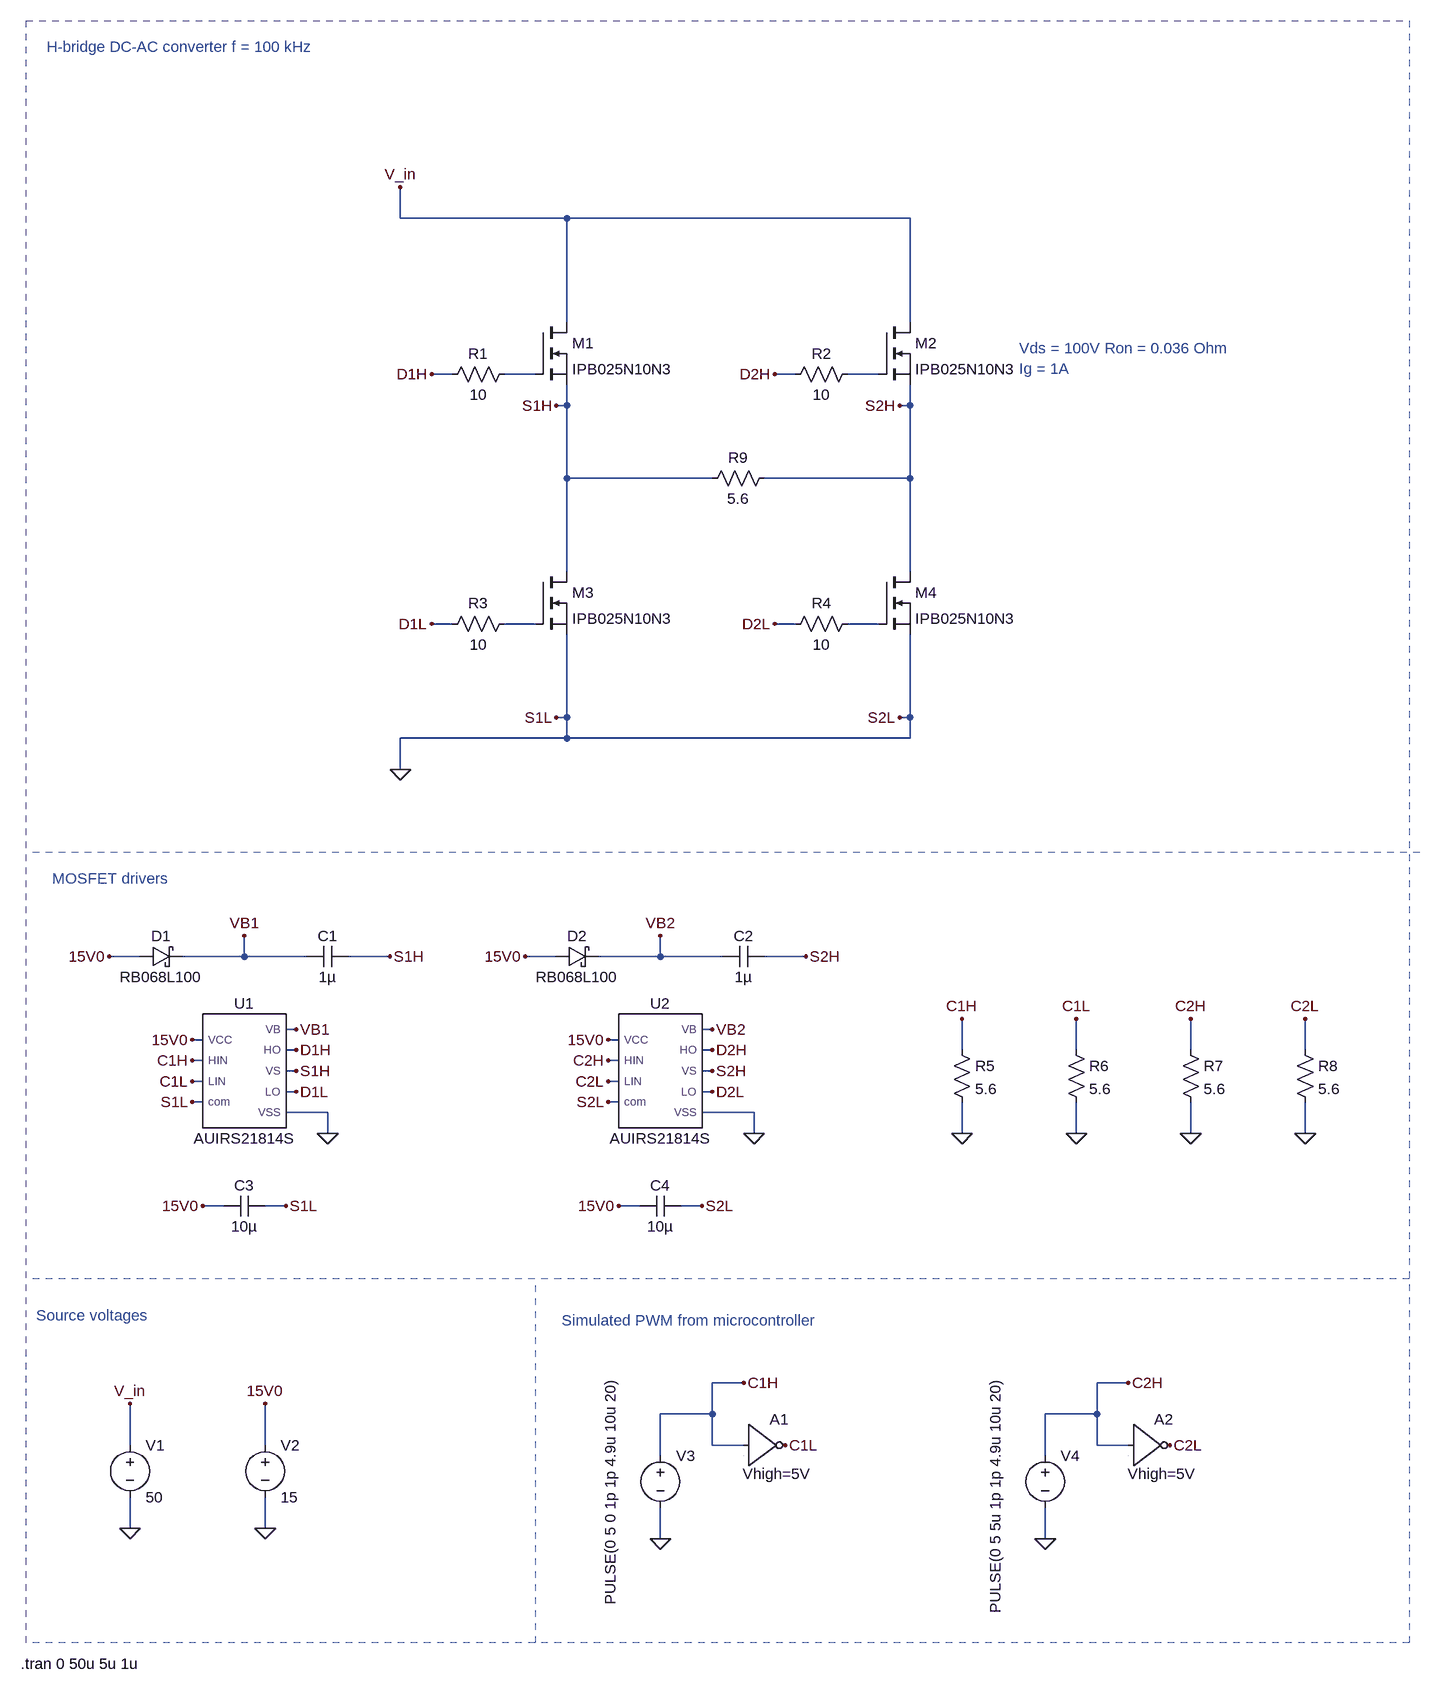
[diagram p0: schematic bridge_driver.asc]
bridge_driver.asc, the LTspice schematic file:
Version 4
SHEET 1 2980 1604
WIRE 1408 -896 1408 -944
WIRE 1664 -896 1408 -896
WIRE 2192 -896 1664 -896
WIRE 1664 -736 1664 -896
WIRE 2192 -736 2192 -896
WIRE 1488 -656 1456 -656
WIRE 1616 -656 1568 -656
WIRE 2016 -656 1984 -656
WIRE 2144 -656 2096 -656
WIRE 1664 -608 1664 -640
WIRE 1664 -608 1648 -608
WIRE 2192 -608 2192 -640
WIRE 2192 -608 2176 -608
WIRE 1664 -496 1664 -608
WIRE 1888 -496 1664 -496
WIRE 2192 -496 2192 -608
WIRE 2192 -496 1968 -496
WIRE 1664 -352 1664 -496
WIRE 2192 -352 2192 -496
WIRE 1488 -272 1456 -272
WIRE 1616 -272 1568 -272
WIRE 2016 -272 1984 -272
WIRE 2144 -272 2096 -272
WIRE 1664 -128 1664 -256
WIRE 1664 -128 1648 -128
WIRE 2192 -128 2192 -256
WIRE 2192 -128 2176 -128
WIRE 1664 -96 1664 -128
WIRE 1664 -96 1408 -96
WIRE 2192 -96 2192 -128
WIRE 2192 -96 1664 -96
WIRE 1408 -48 1408 -96
WIRE 1008 240 960 240
WIRE 1168 240 1168 208
WIRE 1168 240 1072 240
WIRE 1264 240 1168 240
WIRE 1392 240 1328 240
WIRE 1648 240 1600 240
WIRE 1808 240 1808 208
WIRE 1808 240 1712 240
WIRE 1904 240 1808 240
WIRE 2032 240 1968 240
WIRE 1248 352 1232 352
WIRE 1888 352 1872 352
WIRE 1104 368 1088 368
WIRE 1744 368 1728 368
WIRE 1248 384 1232 384
WIRE 1888 384 1872 384
WIRE 2272 384 2272 336
WIRE 2448 384 2448 336
WIRE 2624 384 2624 336
WIRE 2800 384 2800 336
WIRE 1104 400 1088 400
WIRE 1744 400 1728 400
WIRE 1248 416 1232 416
WIRE 1888 416 1872 416
WIRE 1104 432 1088 432
WIRE 1744 432 1728 432
WIRE 1248 448 1232 448
WIRE 1888 448 1872 448
WIRE 1104 464 1088 464
WIRE 1744 464 1728 464
WIRE 1296 480 1232 480
WIRE 1952 480 1872 480
WIRE 1296 512 1296 480
WIRE 1952 512 1952 480
WIRE 2272 512 2272 464
WIRE 2448 512 2448 464
WIRE 2624 512 2624 464
WIRE 2800 512 2800 464
WIRE 1136 624 1104 624
WIRE 1232 624 1200 624
WIRE 1776 624 1744 624
WIRE 1872 624 1840 624
WIRE 1936 896 1888 896
WIRE 2528 896 2480 896
WIRE 1888 944 1888 896
WIRE 1888 944 1808 944
WIRE 2480 944 2480 896
WIRE 2480 944 2400 944
WIRE 992 992 992 928
WIRE 1200 992 1200 928
WIRE 1888 992 1888 944
WIRE 1936 992 1888 992
WIRE 2480 992 2480 944
WIRE 2528 992 2480 992
WIRE 1808 1008 1808 944
WIRE 2400 1008 2400 944
WIRE 992 1120 992 1072
WIRE 1200 1120 1200 1072
WIRE 1808 1136 1808 1088
WIRE 2400 1136 2400 1088
FLAG 992 1120 0
FLAG 1200 1120 0
FLAG 992 928 V_in
FLAG 1200 928 15V0
FLAG 960 240 15V0
FLAG 1168 208 VB1
FLAG 1392 240 S1H
FLAG 1408 -48 0
FLAG 1408 -944 V_in
FLAG 2176 -608 S2H
FLAG 1648 -608 S1H
FLAG 1648 -128 S1L
FLAG 2176 -128 S2L
FLAG 1456 -656 D1H
FLAG 1984 -656 D2H
FLAG 1984 -272 D2L
FLAG 1456 -272 D1L
FLAG 1600 240 15V0
FLAG 1808 208 VB2
FLAG 2032 240 S2H
FLAG 2272 512 0
FLAG 2448 512 0
FLAG 2624 512 0
FLAG 2800 512 0
FLAG 2272 336 C1H
FLAG 2448 336 C1L
FLAG 2624 336 C2H
FLAG 2800 336 C2L
FLAG 1808 1136 0
FLAG 1088 368 15V0
FLAG 1728 368 15V0
FLAG 1088 400 C1H
FLAG 1088 432 C1L
FLAG 1728 400 C2H
FLAG 1728 432 C2L
FLAG 1088 464 S1L
FLAG 1728 464 S2L
FLAG 1296 512 0
FLAG 1952 512 0
FLAG 1248 416 S1H
FLAG 1888 416 S2H
FLAG 1248 352 VB1
FLAG 1888 352 VB2
FLAG 1248 384 D1H
FLAG 1248 448 D1L
FLAG 1888 384 D2H
FLAG 1888 448 D2L
FLAG 1104 624 15V0
FLAG 1232 624 S1L
FLAG 1744 624 15V0
FLAG 1872 624 S2L
FLAG 1936 896 C1H
FLAG 2000 992 C1L
FLAG 2400 1136 0
FLAG 2528 896 C2H
FLAG 2592 992 C2L
SYMBOL AUIRS21814S 1168 416 R0
SYMATTR InstName U1
SYMBOL cap 1328 224 R90
WINDOW 0 0 32 VBottom 2
WINDOW 3 32 32 VTop 2
SYMATTR InstName C1
SYMATTR Value 1µ
SYMBOL schottky 1008 256 R270
WINDOW 0 32 32 VTop 2
WINDOW 3 0 32 VBottom 2
SYMATTR InstName D1
SYMATTR Value RB068L100
SYMATTR Description Diode
SYMATTR Type diode
SYMBOL voltage 992 976 R0
WINDOW 123 0 0 Left 0
WINDOW 39 0 0 Left 0
SYMATTR InstName V1
SYMATTR Value 50
SYMBOL voltage 1200 976 R0
WINDOW 123 0 0 Left 0
WINDOW 39 0 0 Left 0
SYMATTR InstName V2
SYMATTR Value 15
SYMBOL nmos 1616 -736 R0
SYMATTR InstName M1
SYMATTR Value IPB025N10N3
SYMBOL res 1584 -672 R90
WINDOW 0 0 56 VBottom 2
WINDOW 3 32 56 VTop 2
SYMATTR InstName R1
SYMATTR Value 10
SYMBOL res 2112 -672 R90
WINDOW 0 0 56 VBottom 2
WINDOW 3 32 56 VTop 2
SYMATTR InstName R2
SYMATTR Value 10
SYMBOL res 1584 -288 R90
WINDOW 0 0 56 VBottom 2
WINDOW 3 32 56 VTop 2
SYMATTR InstName R3
SYMATTR Value 10
SYMBOL res 2112 -288 R90
WINDOW 0 0 56 VBottom 2
WINDOW 3 32 56 VTop 2
SYMATTR InstName R4
SYMATTR Value 10
SYMBOL cap 1968 224 R90
WINDOW 0 0 32 VBottom 2
WINDOW 3 32 32 VTop 2
SYMATTR InstName C2
SYMATTR Value 1µ
SYMBOL schottky 1648 256 R270
WINDOW 0 32 32 VTop 2
WINDOW 3 0 32 VBottom 2
SYMATTR InstName D2
SYMATTR Value RB068L100
SYMATTR Description Diode
SYMATTR Type diode
SYMBOL res 2256 368 R0
SYMATTR InstName R5
SYMATTR Value 5.6
SYMBOL res 2432 368 R0
SYMATTR InstName R6
SYMATTR Value 5.6
SYMBOL res 2608 368 R0
SYMATTR InstName R7
SYMATTR Value 5.6
SYMBOL res 2784 368 R0
SYMATTR InstName R8
SYMATTR Value 5.6
SYMBOL voltage 1808 992 R0
WINDOW 3 -77 -105 VRight 2
WINDOW 123 0 0 Left 0
WINDOW 39 0 0 Left 0
SYMATTR Value PULSE(0 5 0 1p 1p 4.9u 10u 20)
SYMATTR InstName V3
SYMBOL AUIRS21814S 1808 416 R0
SYMATTR InstName U2
SYMBOL cap 1200 608 R90
WINDOW 0 0 32 VBottom 2
WINDOW 3 32 32 VTop 2
SYMATTR InstName C3
SYMATTR Value 10µ
SYMBOL cap 1840 608 R90
WINDOW 0 0 32 VBottom 2
WINDOW 3 32 32 VTop 2
SYMATTR InstName C4
SYMATTR Value 10µ
SYMBOL Digital\\inv 1936 928 R0
WINDOW 3 -1 108 Left 2
SYMATTR Value Vhigh=5V
SYMATTR InstName A1
SYMBOL voltage 2400 992 R0
WINDOW 3 -77 -105 VRight 2
WINDOW 123 0 0 Left 0
WINDOW 39 0 0 Left 0
SYMATTR Value PULSE(0 5 5u 1p 1p 4.9u 10u 20)
SYMATTR InstName V4
SYMBOL Digital\\inv 2528 928 R0
WINDOW 3 -1 108 Left 2
SYMATTR Value Vhigh=5V
SYMATTR InstName A2
SYMBOL nmos 2144 -736 R0
SYMATTR InstName M2
SYMATTR Value IPB025N10N3
SYMBOL nmos 1616 -352 R0
SYMATTR InstName M3
SYMATTR Value IPB025N10N3
SYMBOL nmos 2144 -352 R0
SYMATTR InstName M4
SYMATTR Value IPB025N10N3
SYMBOL res 1984 -512 R90
WINDOW 0 0 56 VBottom 2
WINDOW 3 32 56 VTop 2
SYMATTR InstName R9
SYMATTR Value 5.6
TEXT 864 -1160 Left 2 ;H-bridge DC-AC converter f = 100 kHz
TEXT 872 120 Left 2 ;MOSFET drivers
TEXT 848 792 Left 2 ;Source voltages
TEXT 1656 800 Left 2 ;Simulated PWM from microcontroller
TEXT 824 1328 Left 2 !.tran 0 50u 5u 1u
TEXT 2360 -696 Left 2 ;Vds = 100V Ron = 0.036 Ohm\nIg = 1A
LINE Normal 2976 80 832 80 2
LINE Normal 1616 1296 1616 736 2
LINE Normal 2960 736 832 736 2
RECTANGLE Normal 2960 1296 832 -1200 2

The netlist it stands for:
* bridge_driver.asc
XU1 15V0 C1H C1L 0 VB1 D1H S1H D1L 0 AUIRS21814S T1=-40 T2=25 T3=125 V1=10 V2=15 V3=20 toffT1=185n toffT2=220n toffT3=265n toffV1=250n toffV2=220n toffV3=190n tonT1=140n tonT2=180n tonT3=210n tonV1=210n tonV2=180n tonV3=155n VOH=1.2 VOL=0.1  ; pins VCC HIN LIN com VB HO VS LO VSS
C1 S1H VB1 1µ
D1 15V0 VB1 RB068L100
V1 V_in 0 50
V2 15V0 0 15
M1 V_in N001 S1H S1H IPB025N10N3
R1 N001 D1H 10
R2 N002 D2H 10
R3 N003 D1L 10
R4 N004 D2L 10
C2 S2H VB2 1µ
D2 15V0 VB2 RB068L100
R5 C1H 0 5.6
R6 C1L 0 5.6
R7 C2H 0 5.6
R8 C2L 0 5.6
V3 C1H 0 PULSE(0 5 0 1p 1p 4.9u 10u 20)
XU2 15V0 C2H C2L 0 VB2 D2H S2H D2L 0 AUIRS21814S T1=-40 T2=25 T3=125 V1=10 V2=15 V3=20 toffT1=185n toffT2=220n toffT3=265n toffV1=250n toffV2=220n toffV3=190n tonT1=140n tonT2=180n tonT3=210n tonV1=210n tonV2=180n tonV3=155n VOH=1.2 VOL=0.1  ; pins VCC HIN LIN com VB HO VS LO VSS
C3 0 15V0 10µ
C4 0 15V0 10µ
A1 C1H 0 0 0 0 C1L 0 0 BUF Vhigh=5V
V4 C2H 0 PULSE(0 5 5u 1p 1p 4.9u 10u 20)
A2 C2H 0 0 0 0 C2L 0 0 BUF Vhigh=5V
M2 V_in N002 S2H S2H IPB025N10N3
M3 S1H N003 0 0 IPB025N10N3
M4 S2H N004 0 0 IPB025N10N3
R9 S2H S1H 5.6
.model D D
.lib standard.dio
.model NMOS NMOS
.model PMOS PMOS
.lib standard.mos
* H-bridge DC-AC converter f = 100 kHz
* MOSFET drivers
* Source voltages
* Simulated PWM from microcontroller
.tran 0 50u 5u 1u
* Vds = 100V Ron = 0.036 Ohm
* Ig = 1A
.lib \\files.auckland.ac.nz\myhome\Documents\GitHub\2020-srw-rc-car\PrimaryConverter\Firmware\LTspice\AUIRS21814Sv1.1.lib
.backanno
.end